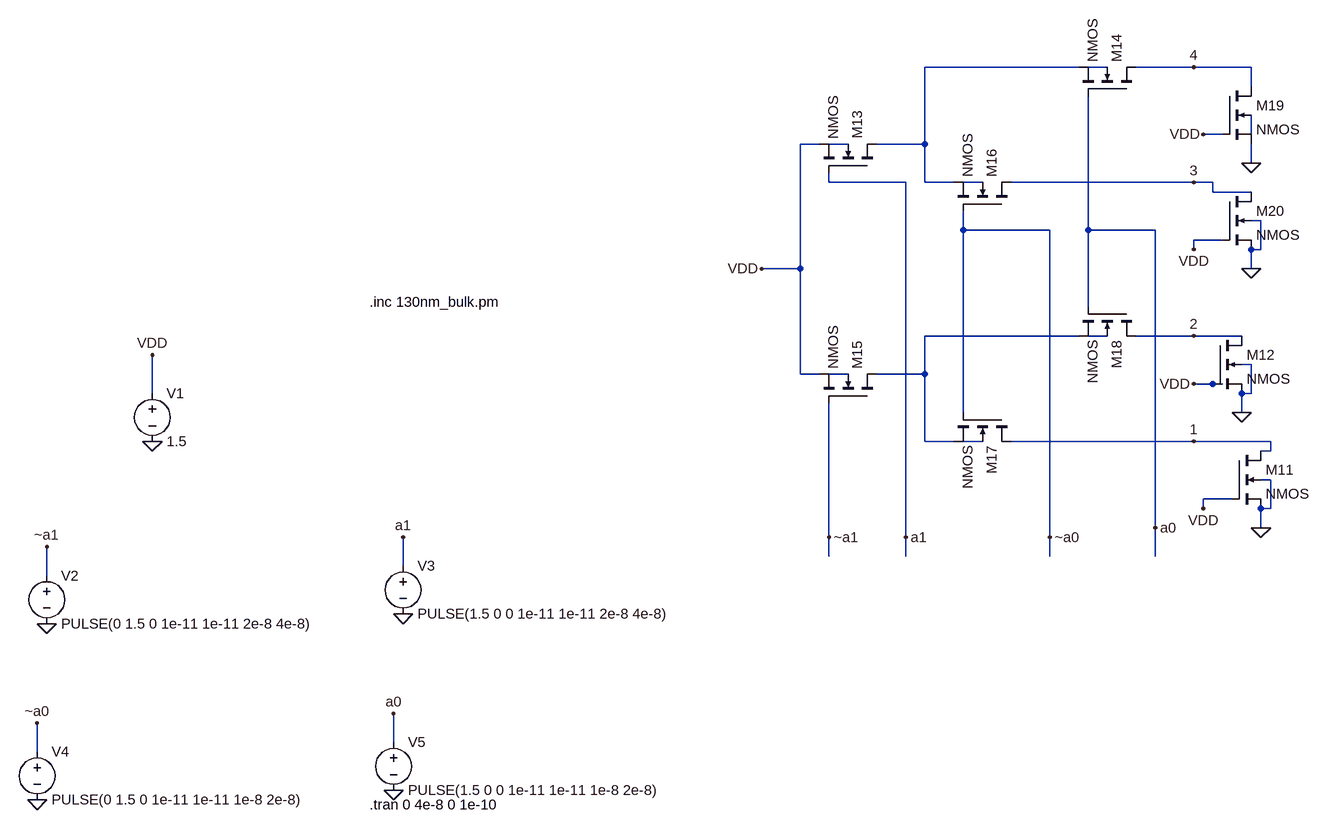
[diagram p0: schematic Decoder.asc]
Decoder.asc, the LTspice schematic file:
Version 4
SHEET 1 2228 808
WIRE 1840 -544 1584 -544
WIRE 1888 -544 1856 -544
WIRE 2032 -544 1936 -544
WIRE 2128 -544 2032 -544
WIRE 2128 -512 2128 -544
WIRE 2080 -432 2048 -432
WIRE 2128 -432 2128 -464
WIRE 1408 -416 1376 -416
WIRE 1456 -416 1424 -416
WIRE 1584 -416 1584 -544
WIRE 1584 -416 1504 -416
WIRE 2128 -384 2128 -416
WIRE 1424 -352 1424 -368
WIRE 1552 -352 1424 -352
WIRE 1584 -352 1584 -416
WIRE 1632 -352 1584 -352
WIRE 1680 -352 1648 -352
WIRE 2032 -352 1728 -352
WIRE 2064 -352 2032 -352
WIRE 2064 -336 2064 -352
WIRE 2128 -336 2064 -336
WIRE 2144 -288 2128 -288
WIRE 1648 -272 1648 -304
WIRE 1792 -272 1648 -272
WIRE 1856 -272 1856 -496
WIRE 1968 -272 1856 -272
WIRE 2080 -256 2032 -256
WIRE 2032 -240 2032 -256
WIRE 2144 -240 2144 -288
WIRE 2144 -240 2128 -240
WIRE 1376 -208 1376 -416
WIRE 1376 -208 1312 -208
WIRE 2128 -208 2128 -240
WIRE 1856 -144 1856 -272
WIRE 1840 -96 1584 -96
WIRE 1888 -96 1856 -96
WIRE 2032 -96 1936 -96
WIRE 2112 -96 2032 -96
WIRE 2128 -48 2112 -48
WIRE 1376 -32 1376 -208
WIRE 1408 -32 1376 -32
WIRE 1456 -32 1424 -32
WIRE 1584 -32 1584 -96
WIRE 1584 -32 1504 -32
WIRE 2064 -16 2032 -16
WIRE 2080 -16 2064 -16
WIRE -1696 0 -1696 -64
WIRE 2128 0 2128 -48
WIRE 2128 0 2112 0
WIRE 1648 32 1648 -272
WIRE 2112 32 2112 0
WIRE 1584 80 1584 -32
WIRE 1632 80 1584 80
WIRE 1680 80 1648 80
WIRE 2032 80 1728 80
WIRE 2160 80 2032 80
WIRE 2160 96 2160 80
WIRE 2160 96 2144 96
WIRE 2160 144 2144 144
WIRE 2096 176 2048 176
WIRE 2048 192 2048 176
WIRE 2160 192 2160 144
WIRE 2160 192 2144 192
WIRE 1968 224 1968 -272
WIRE 2144 224 2144 192
WIRE 1424 240 1424 16
WIRE 1552 240 1552 -352
WIRE 1792 240 1792 -272
WIRE 1424 272 1424 240
WIRE 1552 272 1552 240
WIRE 1792 272 1792 240
WIRE 1968 272 1968 224
WIRE -1248 288 -1248 240
WIRE -1872 304 -1872 256
WIRE -1264 672 -1264 624
WIRE -1888 688 -1888 640
FLAG -1696 80 0
FLAG -1248 368 0
FLAG -1264 752 0
FLAG -1248 240 a1
FLAG -1264 624 a0
FLAG -1872 384 0
FLAG -1888 768 0
FLAG -1872 256 ~a1
FLAG -1888 640 ~a0
FLAG 1312 -208 VDD
FLAG 1968 224 a0
FLAG 1792 240 ~a0
FLAG 1552 240 a1
FLAG 1424 240 ~a1
FLAG 2032 80 1
FLAG 2032 -96 2
FLAG 2032 -352 3
FLAG 2032 -544 4
FLAG 2128 -384 0
FLAG 2048 -432 VDD
FLAG -1696 -64 VDD
FLAG 2144 224 0
FLAG 2048 192 VDD
FLAG 2112 32 0
FLAG 2128 -208 0
FLAG 2032 -240 VDD
FLAG 2032 -16 VDD
SYMBOL voltage -1696 -16 R0
WINDOW 123 0 0 Left 0
WINDOW 39 0 0 Left 0
SYMATTR InstName V1
SYMATTR Value 1.5
SYMBOL voltage -1248 272 R0
WINDOW 123 0 0 Left 0
WINDOW 39 0 0 Left 0
SYMATTR InstName V3
SYMATTR Value PULSE(1.5 0 0 1e-11 1e-11 2e-8 4e-8)
SYMBOL voltage -1264 656 R0
WINDOW 123 0 0 Left 0
WINDOW 39 0 0 Left 0
SYMATTR InstName V5
SYMATTR Value PULSE(1.5 0 0 1e-11 1e-11 1e-8 2e-8)
SYMBOL voltage -1872 288 R0
WINDOW 123 0 0 Left 0
WINDOW 39 0 0 Left 0
SYMATTR InstName V2
SYMATTR Value PULSE(0 1.5 0 1e-11 1e-11 2e-8 4e-8)
SYMBOL voltage -1888 672 R0
WINDOW 123 0 0 Left 0
WINDOW 39 0 0 Left 0
SYMATTR InstName V4
SYMATTR Value PULSE(0 1.5 0 1e-11 1e-11 1e-8 2e-8)
SYMBOL nmos4 1504 -368 M270
SYMATTR InstName M13
SYMATTR Value2 l=130e-9 w=1300e-9 ad=676000e-18 as=676000e-18 pd=3640e-9 ps=3640e-9
SYMBOL nmos4 1504 16 M270
SYMATTR InstName M15
SYMATTR Value2 l=130e-9 w=1300e-9 ad=676000e-18 as=676000e-18 pd=3640e-9 ps=3640e-9
SYMBOL nmos4 1728 -304 M270
SYMATTR InstName M16
SYMATTR Value2 l=130e-9 w=1300e-9 ad=676000e-18 as=676000e-18 pd=3640e-9 ps=3640e-9
SYMBOL nmos4 1728 32 R90
SYMATTR InstName M17
SYMATTR Value2 l=130e-9 w=1300e-9 ad=676000e-18 as=676000e-18 pd=3640e-9 ps=3640e-9
SYMBOL nmos4 1936 -496 M270
SYMATTR InstName M14
SYMATTR Value2 l=130e-9 w=1300e-9 ad=676000e-18 as=676000e-18 pd=3640e-9 ps=3640e-9
SYMBOL nmos4 1936 -144 R90
SYMATTR InstName M18
SYMATTR Value2 l=130e-9 w=1300e-9 ad=676000e-18 as=676000e-18 pd=3640e-9 ps=3640e-9
SYMBOL nmos4 2080 -512 R0
SYMATTR InstName M19
SYMATTR Value2 l=130e-9 w=1300e-9 ad=676000e-18 as=676000e-18 pd=3640e-9 ps=3640e-9
SYMBOL nmos4 2096 96 R0
SYMATTR InstName M11
SYMATTR Value2 l=130e-9 w=1300e-9 ad=676000e-18 as=676000e-18 pd=3640e-9 ps=3640e-9
SYMBOL nmos4 2064 -96 R0
SYMATTR InstName M12
SYMATTR Value2 l=130e-9 w=1300e-9 ad=676000e-18 as=676000e-18 pd=3640e-9 ps=3640e-9
SYMBOL nmos4 2080 -336 R0
SYMATTR InstName M20
SYMATTR Value2 l=130e-9 w=1300e-9 ad=676000e-18 as=676000e-18 pd=3640e-9 ps=3640e-9
TEXT -1304 -152 Left 2 !.inc 130nm_bulk.pm
TEXT -1304 776 Left 2 !.tran 0 4e-8 0 1e-10

The netlist it stands for:
* Decoder.asc
V1 VDD 0 1.5
V3 a1 0 PULSE(1.5 0 0 1e-11 1e-11 2e-8 4e-8)
V5 a0 0 PULSE(1.5 0 0 1e-11 1e-11 1e-8 2e-8)
V2 ~a1 0 PULSE(0 1.5 0 1e-11 1e-11 2e-8 4e-8)
V4 ~a0 0 PULSE(0 1.5 0 1e-11 1e-11 1e-8 2e-8)
M13 N001 a1 VDD N004 NMOS l=130e-9 w=1300e-9 ad=676000e-18 as=676000e-18 pd=3640e-9 ps=3640e-9
M15 N006 ~a1 VDD N008 NMOS l=130e-9 w=1300e-9 ad=676000e-18 as=676000e-18 pd=3640e-9 ps=3640e-9
M16 3 ~a0 N001 N005 NMOS l=130e-9 w=1300e-9 ad=676000e-18 as=676000e-18 pd=3640e-9 ps=3640e-9
M17 1 ~a0 N006 N009 NMOS l=130e-9 w=1300e-9 ad=676000e-18 as=676000e-18 pd=3640e-9 ps=3640e-9
M14 4 a0 N001 N002 NMOS l=130e-9 w=1300e-9 ad=676000e-18 as=676000e-18 pd=3640e-9 ps=3640e-9
M18 2 a0 N006 N007 NMOS l=130e-9 w=1300e-9 ad=676000e-18 as=676000e-18 pd=3640e-9 ps=3640e-9
M19 4 VDD 0 N003 NMOS l=130e-9 w=1300e-9 ad=676000e-18 as=676000e-18 pd=3640e-9 ps=3640e-9
M11 1 VDD 0 0 NMOS l=130e-9 w=1300e-9 ad=676000e-18 as=676000e-18 pd=3640e-9 ps=3640e-9
M12 2 VDD 0 0 NMOS l=130e-9 w=1300e-9 ad=676000e-18 as=676000e-18 pd=3640e-9 ps=3640e-9
M20 3 VDD 0 0 NMOS l=130e-9 w=1300e-9 ad=676000e-18 as=676000e-18 pd=3640e-9 ps=3640e-9
.model NMOS NMOS
.model PMOS PMOS
.lib standard.mos
.inc 130nm_bulk.pm
.tran 0 4e-8 0 1e-10
.backanno
.end

* Results of the author's LTspice run, read from the files saved beside the schematic
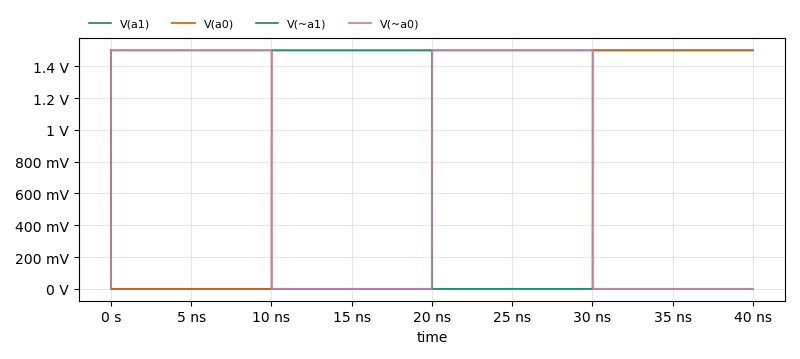
[diagram p1: Transient Analysis of Decoder.asc, plotted from the saved traces]
* Transient Analysis, 1 run:
*   V(a1): min 0 V, max 1.5 V, average 749.6 mV, rms 1.06 V, last 1.5 V
*   V(a0): min 0 V, max 1.5 V, average 749.2 mV, rms 1.06 V, last 1.5 V
*   V(~a1): min 0 V, max 1.5 V, average 750.4 mV, rms 1.061 V, last 0 V
*   V(~a0): min 0 V, max 1.5 V, average 750.7 mV, rms 1.061 V, last 0 V